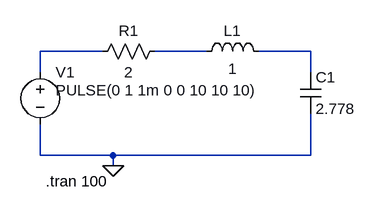
[diagram p0: schematic LTSPICE_CIRCUIT.asc]
LTSPICE_CIRCUIT.asc, the LTspice schematic file:
Version 4
SHEET 1 880 680
WIRE -16 -48 -112 -48
WIRE 144 -48 64 -48
WIRE 304 -48 224 -48
WIRE -112 -16 -112 -48
WIRE 304 -16 304 -48
WIRE -112 112 -112 64
WIRE 0 112 -112 112
WIRE 304 112 304 48
WIRE 304 112 0 112
WIRE 0 128 0 112
FLAG 0 128 0
SYMBOL res 80 -64 R90
WINDOW 0 0 56 VBottom 2
WINDOW 3 32 56 VTop 2
SYMATTR InstName R1
SYMATTR Value 2
SYMBOL ind 128 -32 R270
WINDOW 0 32 56 VTop 2
WINDOW 3 5 56 VBottom 2
SYMATTR InstName L1
SYMATTR Value 1
SYMBOL cap 288 -16 R0
SYMATTR InstName C1
SYMATTR Value 2.778
SYMBOL voltage -112 -32 R0
WINDOW 3 24 44 Left 2
WINDOW 123 0 0 Left 0
WINDOW 39 0 0 Left 0
SYMATTR Value PULSE(0 1 1m 0 0 10 10 10)
SYMATTR InstName V1
TEXT -104 152 Left 2 !.tran 100

The netlist it stands for:
* LTSPICE_CIRCUIT.asc
R1 N002 N001 2
L1 N002 N003 1
C1 N003 0 2.778
V1 N001 0 PULSE(0 1 1m 0 0 10 10 10)
.tran 100
.backanno
.end